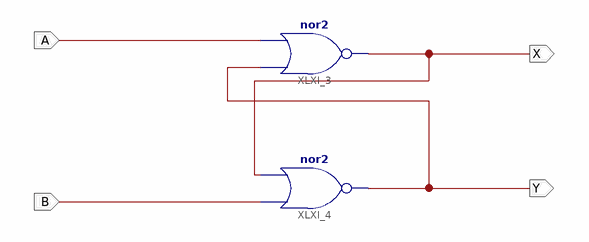
[diagram p0: schematic sheet 1]
// Xilinx ISE schematic Nor_Latch.sch (spartan3e) as structural Verilog: 2 symbols, 4 ports
module Nor_Latch (
  input  A,
  input  B,
  output Y,
  output X
);

  nor XLXI_3 (X, Y, A);
  nor XLXI_4 (Y, B, X);
endmodule
